# EAGLE design v3s-v0.1.0 (EAGLE 9.2.0)

## Sheet 1 of 5
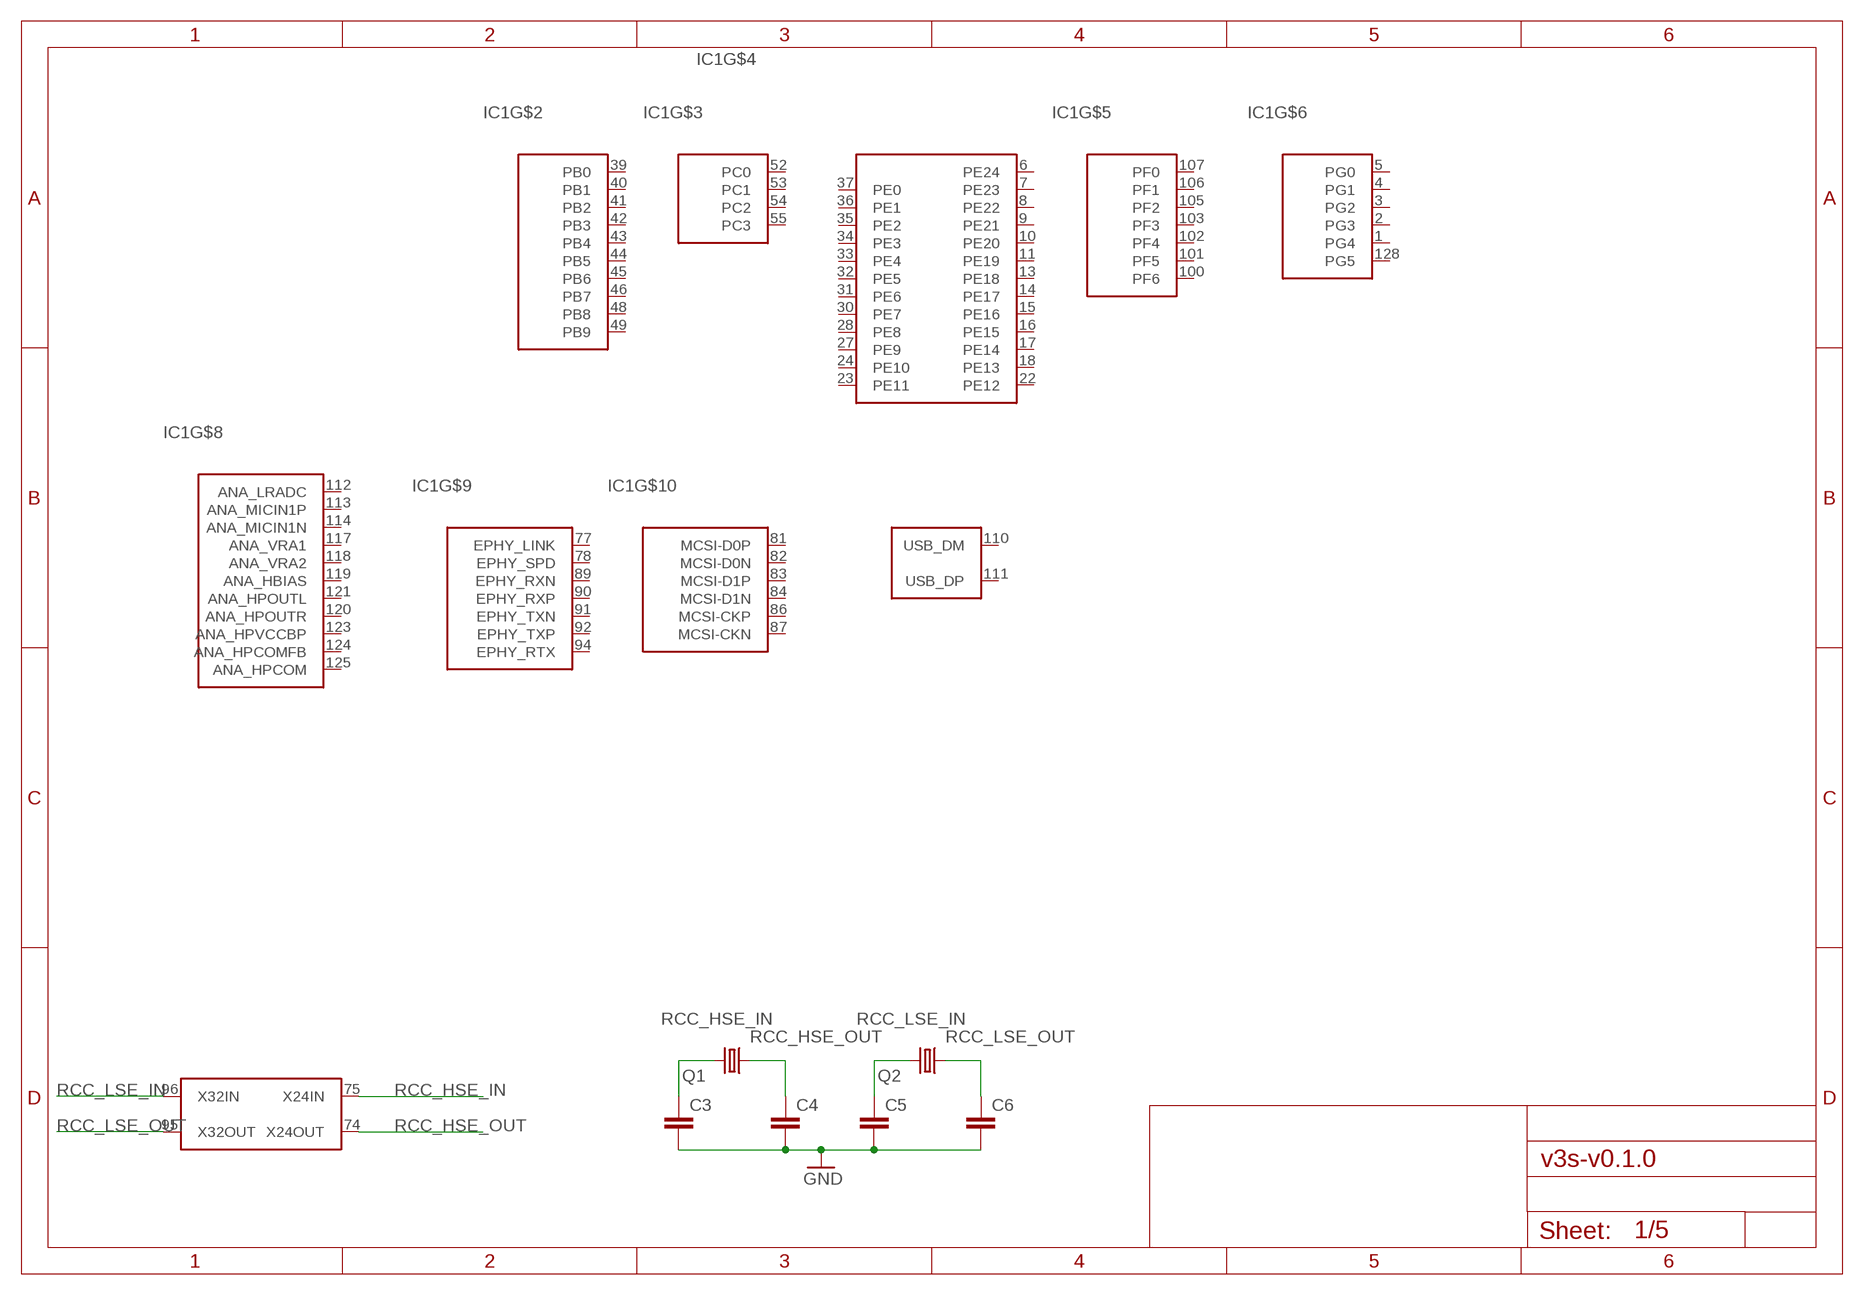
[diagram p0: schematic, sheet 1]

### Parts
C3  C-EUC0402  [C0402]
C4  C-EUC0402  [C0402]
C5  C-EUC0402  [C0402]
C6  C-EUC0402  [C0402]
IC1  V3S  [QFP-128]
Q1  KX-7  [3.2X2.5_KX-7]
Q2  KX-327-NHF  [3.2X1.5]

### Nets
GND: C3.2 C4.2 C5.2 C6.2 ; also sheet 2,4,5
RCC_HSE_IN: C3.1 IC1.75(X24IN) Q1.3
RCC_HSE_OUT: C4.1 IC1.74(X24OUT) Q1.1
RCC_LSE_IN: C5.1 IC1.96(X32IN) Q2.2
RCC_LSE_OUT: C6.1 IC1.95(X32OUT) Q2.1
Unconnected: IC1.1(PG4) IC1.2(PG3) IC1.3(PG2) IC1.4(PG1) IC1.5(PG0) IC1.6(PE24) IC1.7(PE23) IC1.8(PE22) IC1.9(PE21) IC1.10(PE20) IC1.11(PE19) IC1.13(PE18) IC1.14(PE17) IC1.15(PE16) IC1.16(PE15) IC1.17(PE14) IC1.18(PE13) IC1.22(PE12) IC1.23(PE11) IC1.24(PE10) IC1.27(PE9) IC1.28(PE8) IC1.30(PE7) IC1.31(PE6) IC1.32(PE5) IC1.33(PE4) IC1.34(PE3) IC1.35(PE2) IC1.36(PE1) IC1.37(PE0) IC1.39(PB0) IC1.40(PB1) IC1.41(PB2) IC1.42(PB3) IC1.43(PB4) IC1.44(PB5) IC1.45(PB6) IC1.46(PB7) IC1.48(PB8) IC1.49(PB9) IC1.52(PC0) IC1.53(PC1) IC1.54(PC2) IC1.55(PC3) IC1.77(EPHY_LINK) IC1.78(EPHY_SPD) IC1.81(MCSI-D0P) IC1.82(MCSI-D0N) IC1.83(MCSI-D1P) IC1.84(MCSI-D1N) IC1.86(MCSI-CKP) IC1.87(MCSI-CKN) IC1.89(EPHY_RXN) IC1.90(EPHY_RXP) IC1.91(EPHY_TXN) IC1.92(EPHY_TXP) IC1.94(EPHY_RTX) IC1.100(PF6) IC1.101(PF5) IC1.102(PF4) IC1.103(PF3) IC1.105(PF2) IC1.106(PF1) IC1.107(PF0) IC1.110(USB_DM) IC1.111(USB_DP) IC1.112(ANA_LRADC) IC1.113(ANA_MICIN1P) IC1.114(ANA_MICIN1N) IC1.117(ANA_VRA1) IC1.118(ANA_VRA2) IC1.119(ANA_HBIAS) IC1.120(ANA_HPOUTR) IC1.121(ANA_HPOUTL) IC1.123(ANA_HPVCCBP) IC1.124(ANA_HPCOMFB) IC1.125(ANA_HPCOM) IC1.128(PG5)

## Sheet 2 of 5
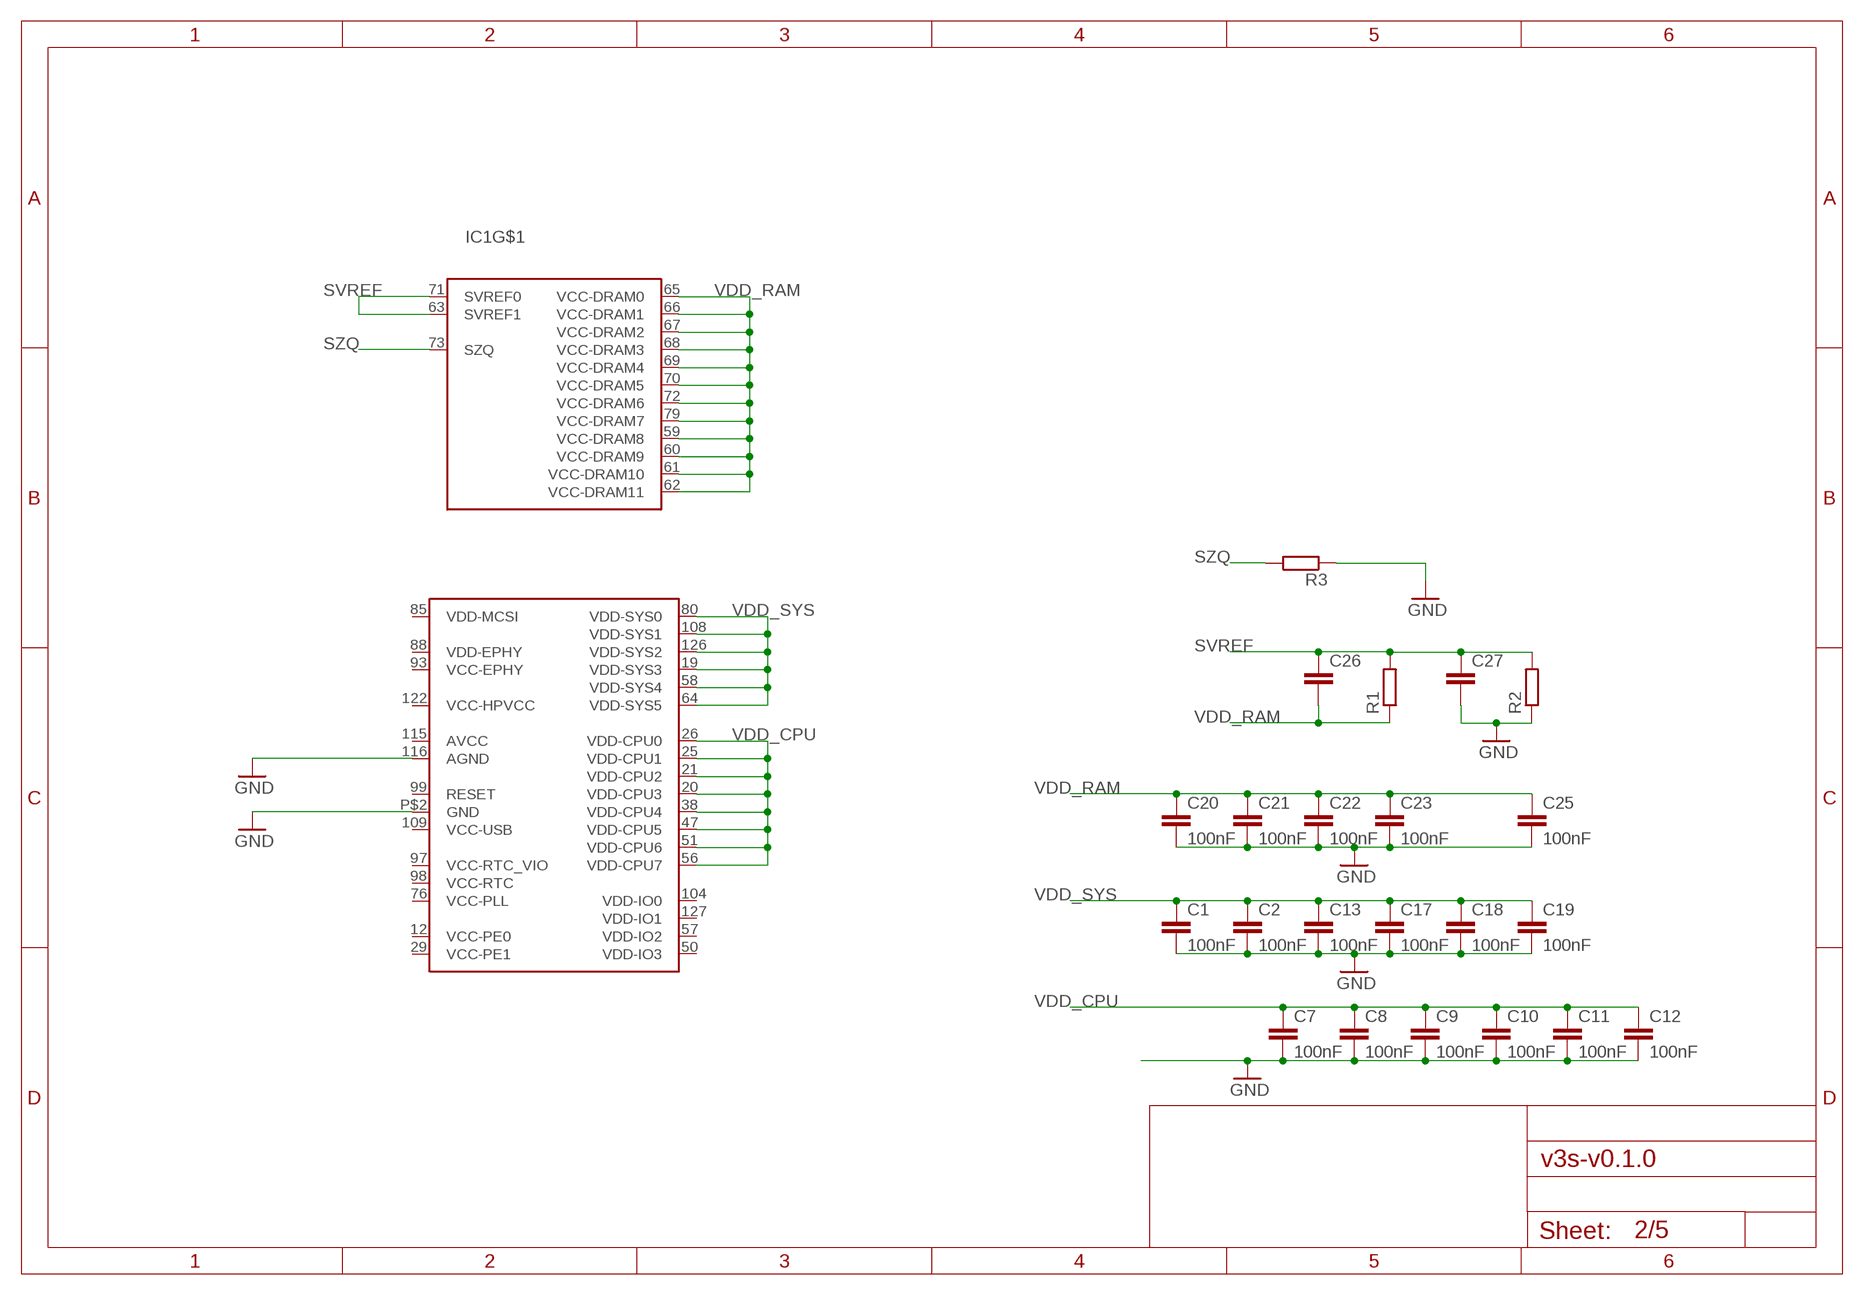
[diagram p1: schematic, sheet 2]

### Parts
C1  100nF  C-EUC0402  [C0402]
C2  100nF  C-EUC0402  [C0402]
C7  100nF  C-EUC0402  [C0402]
C8  100nF  C-EUC0402  [C0402]
C9  100nF  C-EUC0402  [C0402]
C10  100nF  C-EUC0402  [C0402]
C11  100nF  C-EUC0402  [C0402]
C12  100nF  C-EUC0402  [C0402]
C13  100nF  C-EUC0402  [C0402]
C17  100nF  C-EUC0402  [C0402]
C18  100nF  C-EUC0402  [C0402]
C19  100nF  C-EUC0402  [C0402]
C20  100nF  C-EUC0402  [C0402]
C21  100nF  C-EUC0402  [C0402]
C22  100nF  C-EUC0402  [C0402]
C23  100nF  C-EUC0402  [C0402]
C25  100nF  C-EUC0402  [C0402]
C26  C-EUC0402  [C0402]
C27  C-EUC0402  [C0402]
R1  R-EU_R0402  [R0402]
R2  R-EU_R0402  [R0402]
R3  R-EU_R0402  [R0402]

### Nets
GND: C1.2 C2.2 C7.2 C8.2 C9.2 C10.2 C11.2 C12.2 C13.2 C17.2 C18.2 C19.2 C20.2 C21.2 C22.2 C23.2 C25.2 C27.2 IC1.116(AGND) IC1.P$2(GND) R2.1 R3.1 ; also sheet 1,4,5
SVREF: C26.1 C27.1 IC1.63(SVREF1) IC1.71(SVREF0) R1.2 R2.2
SZQ: IC1.73(SZQ) R3.2
VDD_CPU: C7.1 C8.1 C9.1 C10.1 C11.1 C12.1 IC1.20(VDD-CPU3) IC1.21(VDD-CPU2) IC1.25(VDD-CPU1) IC1.26(VDD-CPU0) IC1.38(VDD-CPU4) IC1.47(VDD-CPU5) IC1.51(VDD-CPU6) IC1.56(VDD-CPU7)
VDD_RAM: C20.1 C21.1 C22.1 C23.1 C25.1 C26.2 IC1.59(VCC-DRAM8) IC1.60(VCC-DRAM9) IC1.61(VCC-DRAM10) IC1.62(VCC-DRAM11) IC1.65(VCC-DRAM0) IC1.66(VCC-DRAM1) IC1.67(VCC-DRAM2) IC1.68(VCC-DRAM3) IC1.69(VCC-DRAM4) IC1.70(VCC-DRAM5) IC1.72(VCC-DRAM6) IC1.79(VCC-DRAM7) R1.1
VDD_SYS: C1.1 C2.1 C13.1 C17.1 C18.1 C19.1 IC1.19(VDD-SYS3) IC1.58(VDD-SYS4) IC1.64(VDD-SYS5) IC1.80(VDD-SYS0) IC1.108(VDD-SYS1) IC1.126(VDD-SYS2)
Unconnected: IC1.12(VCC-PE0) IC1.29(VCC-PE1) IC1.50(VDD-IO3) IC1.57(VDD-IO2) IC1.76(VCC-PLL) IC1.85(VDD-MCSI) IC1.88(VDD-EPHY) IC1.93(VCC-EPHY) IC1.97(VCC-RTC_VIO) IC1.98(VCC-RTC) IC1.99(RESET) IC1.104(VDD-IO0) IC1.109(VCC-USB) IC1.115(AVCC) IC1.122(VCC-HPVCC) IC1.127(VDD-IO1)

## Sheet 3 of 5
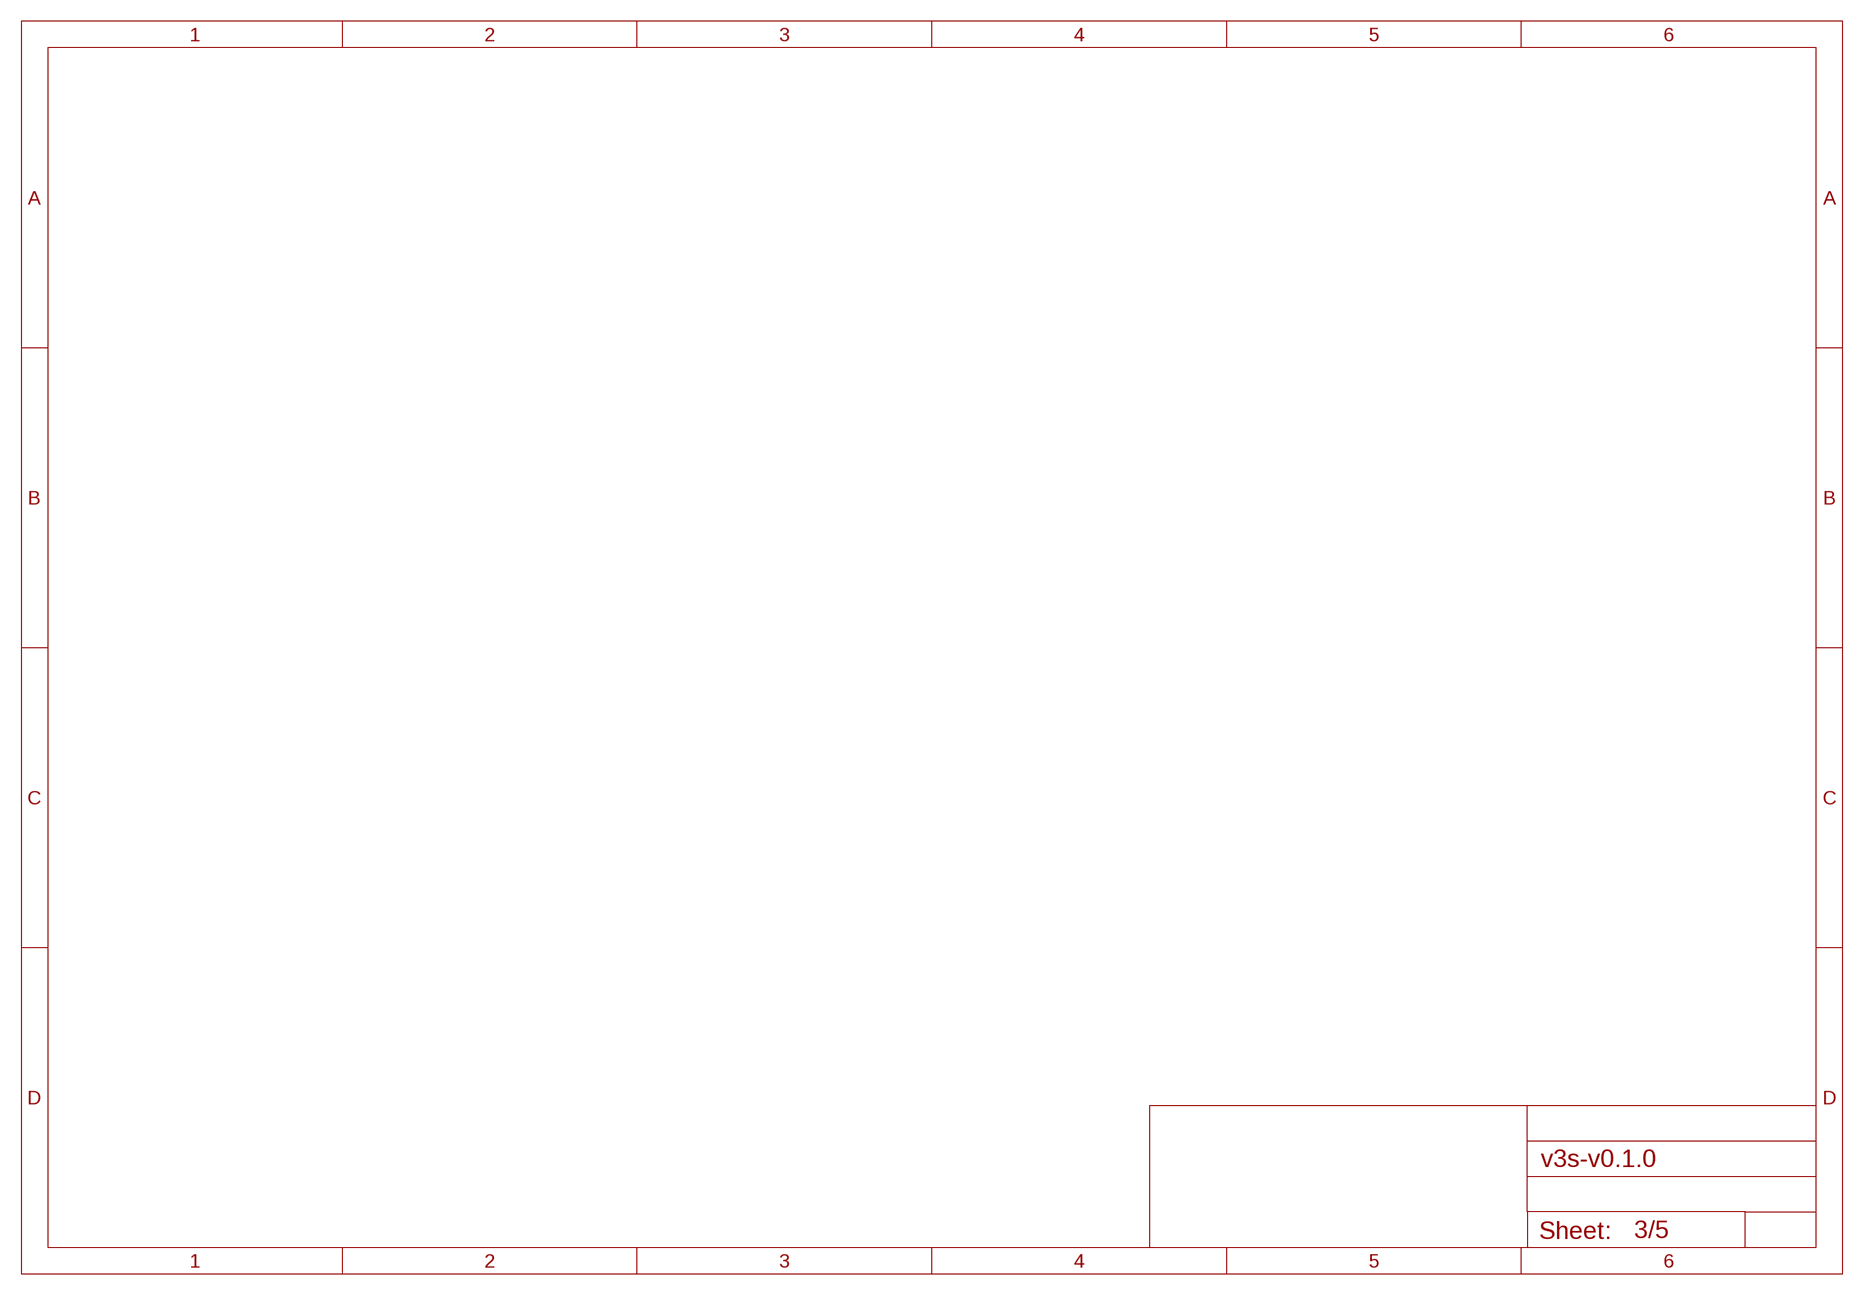
[diagram p2: schematic, sheet 3]

## Sheet 4 of 5
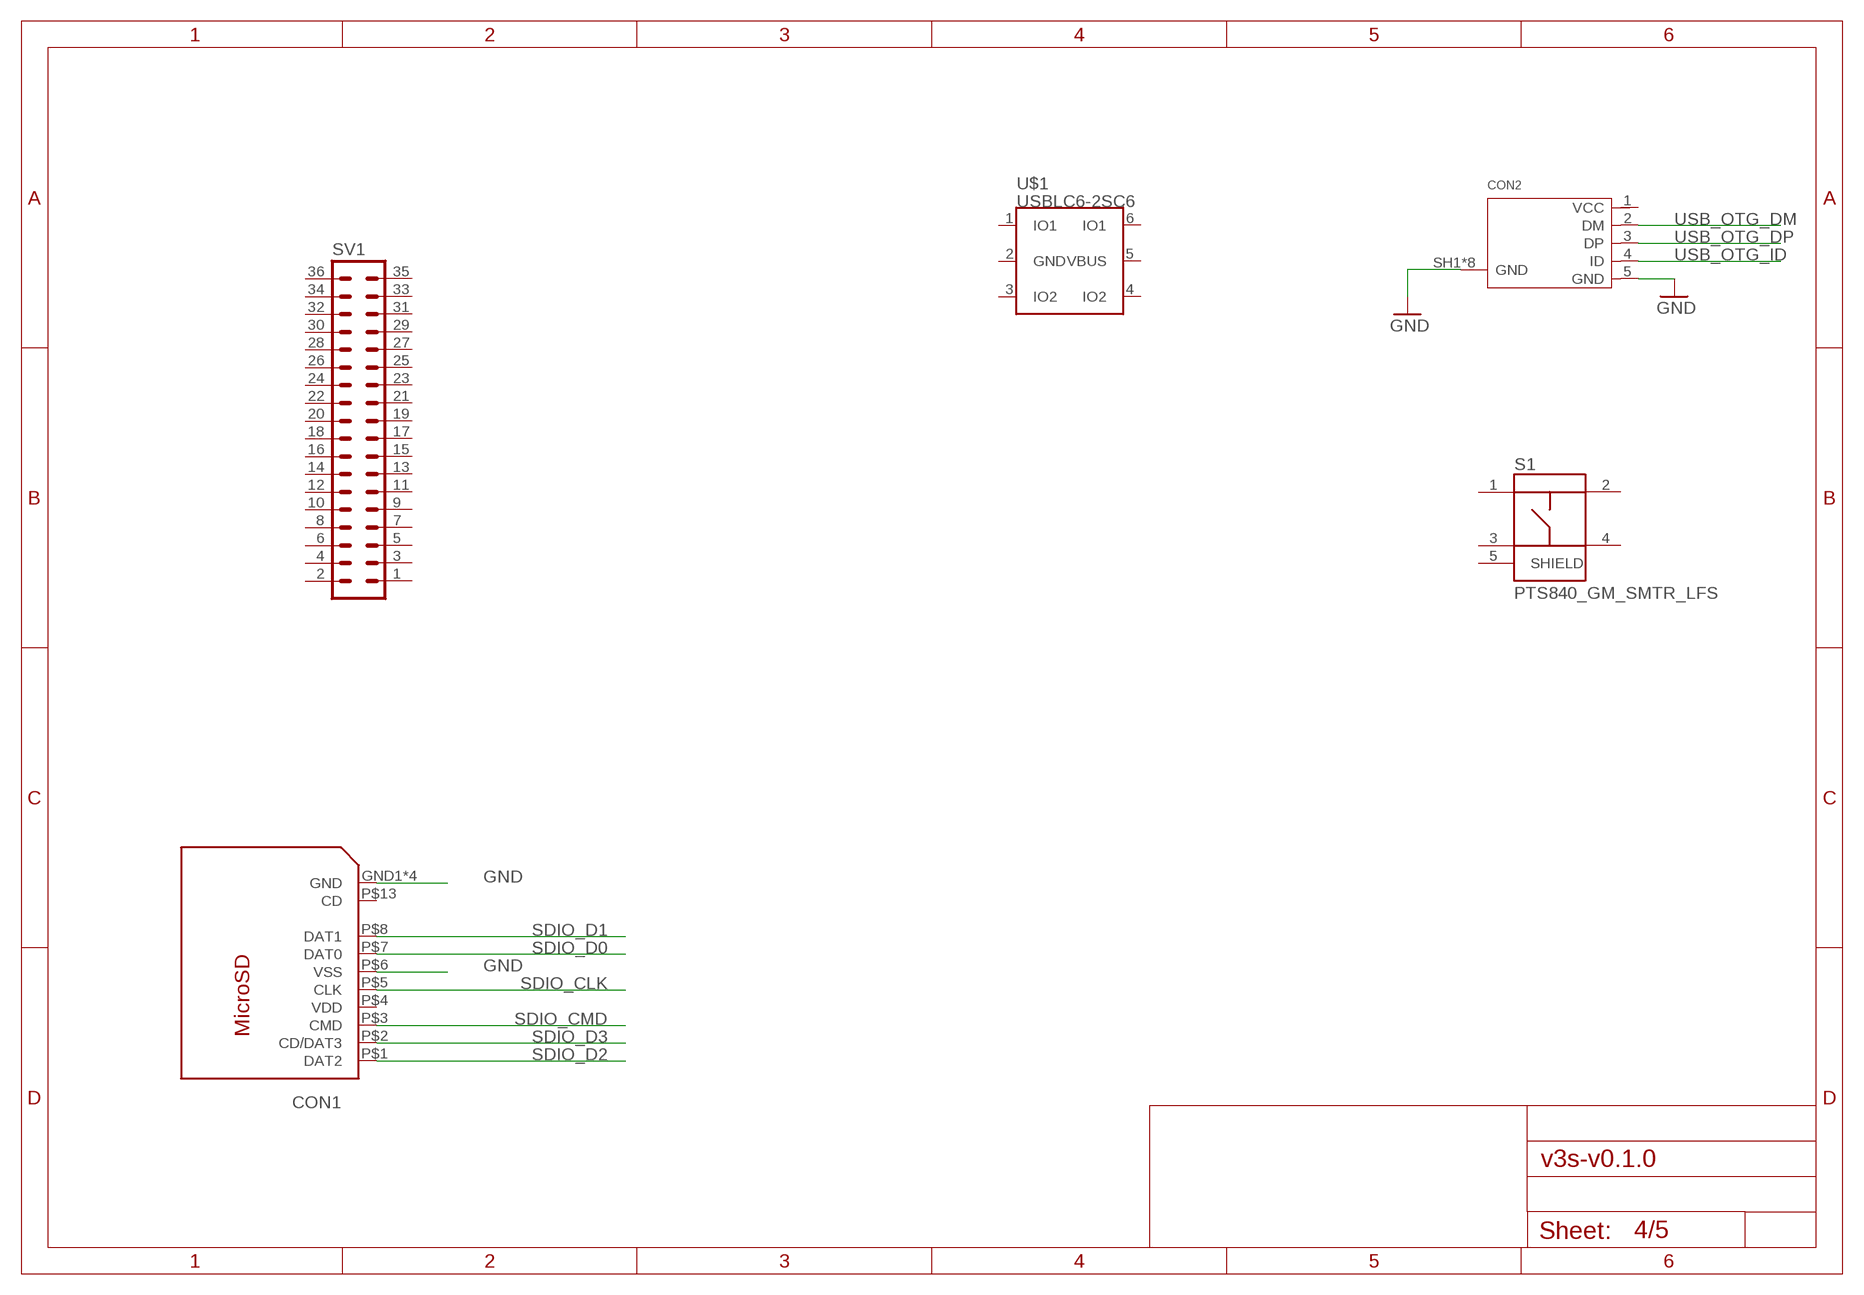
[diagram p3: schematic, sheet 4]

### Parts
CON1  112J-TXAR  [112J]
CON2  10118194-0001LF  [10118194]
S1  PTS840_GM_SMTR_LFS  [SW_PTS840GMSMTRLFS]
SV1  MA18-2  [MA18-2]
U$1  USBLC6-2SC6  [SOT95P280X110-6]

### Nets
GND: CON1.GND1(GND) CON1.GND2(GND) CON1.GND3(GND) CON1.GND4(GND) CON1.P$6(VSS) CON2.5(GND) CON2.SH1(GND) CON2.SH2(GND) CON2.SH3(GND) CON2.SH4(GND) CON2.SH5(GND) CON2.SH6(GND) CON2.SH7(GND) CON2.SH8(GND) ; also sheet 1,2,5
SDIO_CLK: CON1.P$5(CLK)
SDIO_CMD: CON1.P$3(CMD)
SDIO_D0: CON1.P$7(DAT0)
SDIO_D1: CON1.P$8(DAT1)
SDIO_D2: CON1.P$1(DAT2)
SDIO_D3: CON1.P$2(CD/DAT3)
USB_OTG_DM: CON2.2(DM)
USB_OTG_DP: CON2.3(DP)
USB_OTG_ID: CON2.4(ID)
Unconnected: CON1.P$4(VDD) CON1.P$13(CD) CON2.1(VCC) S1.1 S1.2 S1.3 S1.4 S1.5(SHIELD) SV1.1 SV1.2 SV1.3 SV1.4 SV1.5 SV1.6 SV1.7 SV1.8 SV1.9 SV1.10 SV1.11 SV1.12 SV1.13 SV1.14 SV1.15 SV1.16 SV1.17 SV1.18 SV1.19 SV1.20 SV1.21 SV1.22 SV1.23 SV1.24 SV1.25 SV1.26 SV1.27 SV1.28 SV1.29 SV1.30 SV1.31 SV1.32 SV1.33 SV1.34 SV1.35 SV1.36 U$1.1(IO1) U$1.2(GND) U$1.3(IO2) U$1.4(IO2) U$1.5(VBUS) U$1.6(IO1)

## Sheet 5 of 5
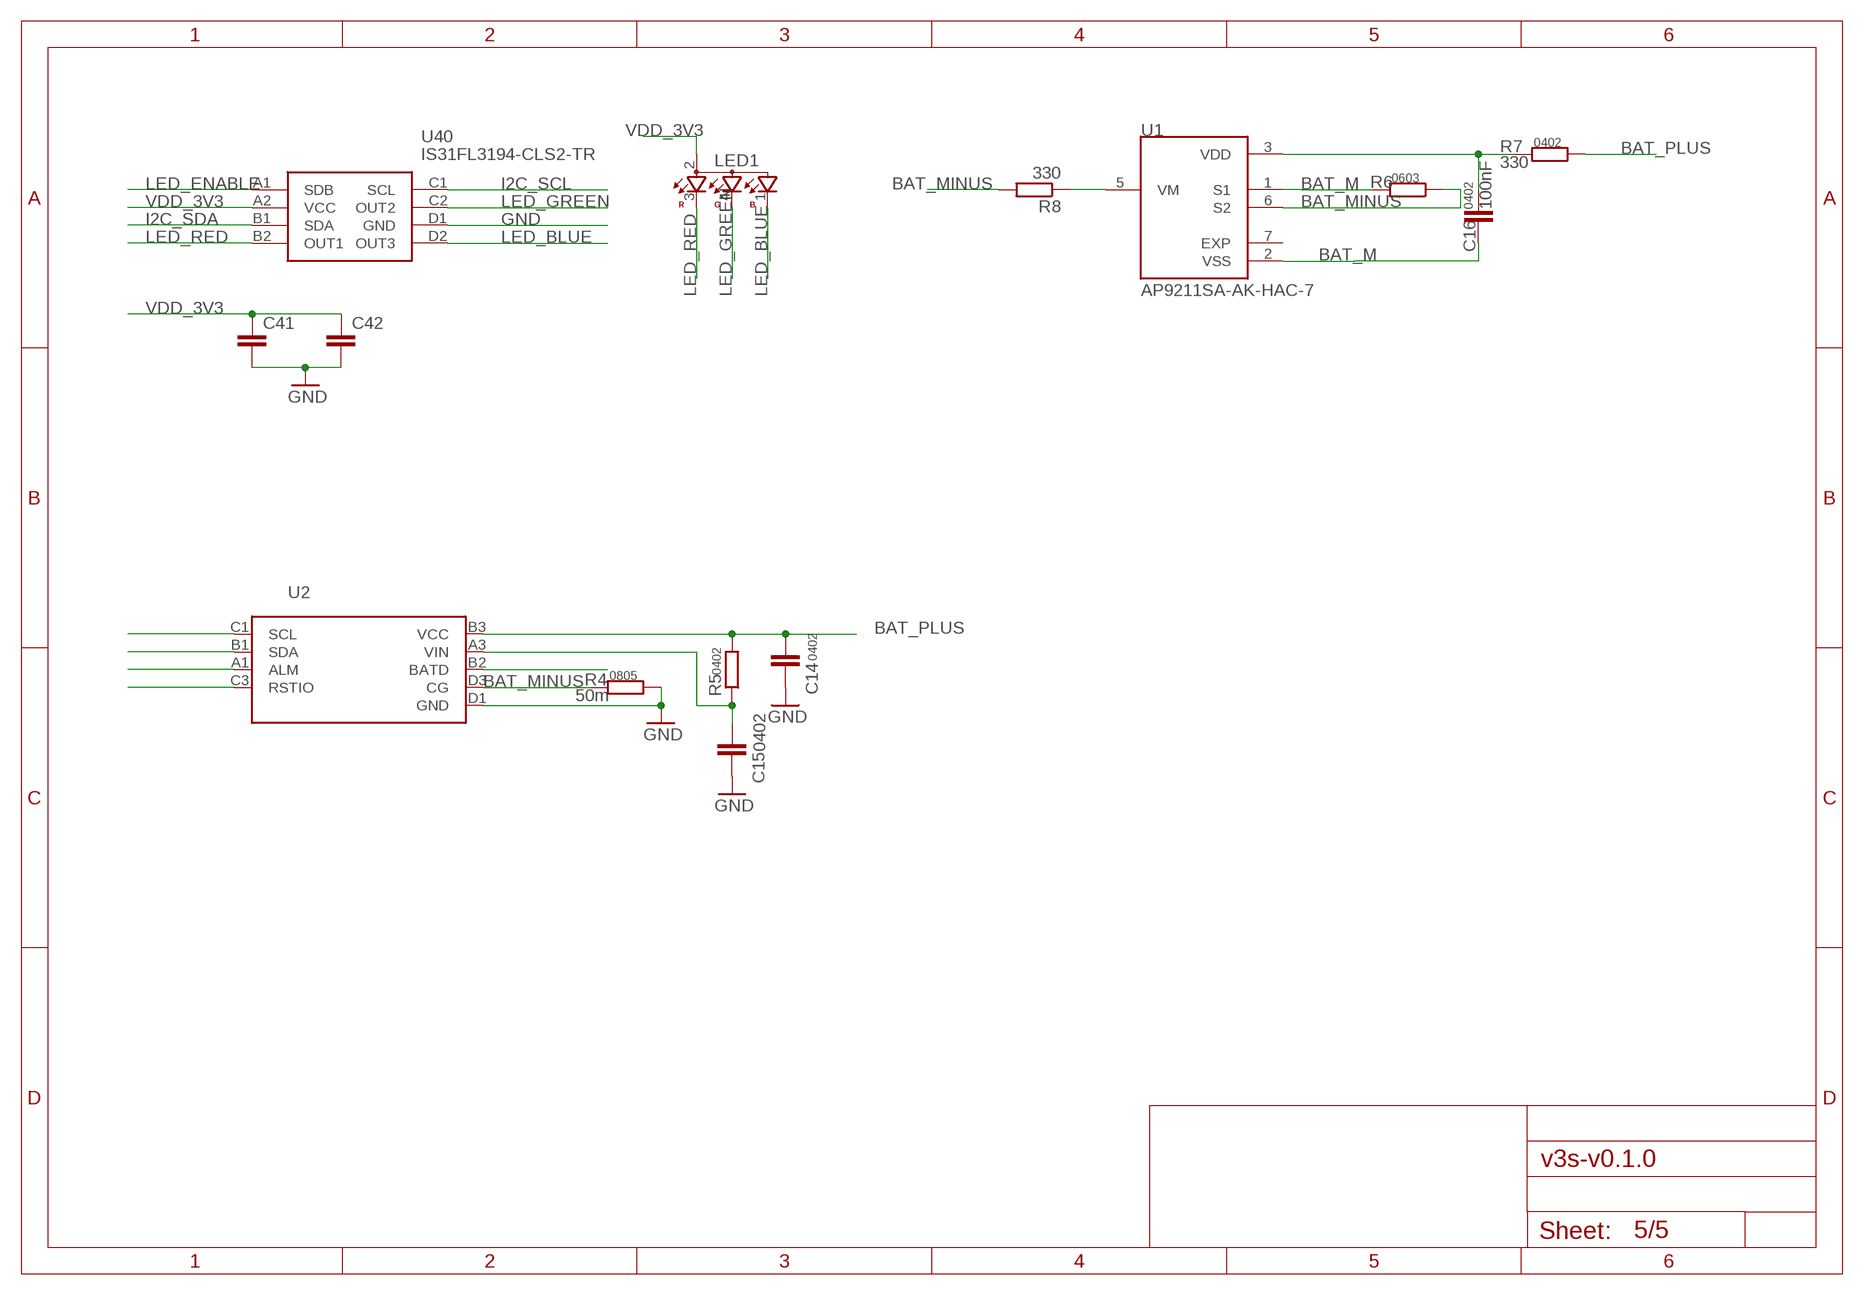
[diagram p4: schematic, sheet 5]

### Parts
C14  C-EUC0402  [C0402]
C15  C-EUC0402  [C0402]
C16  100nF  C-EUC0402  [C0402]
C41  C-EUC0402  [C0402]
C42  C-EUC0402  [C0402]
LED1  OSTB1204C1E  [321015RGB]
R4  50m  R-EU_R0805  [R0805]
R5  R-EU_R0402  [R0402]
R6  R-EU_R0603  [R0603]
R7  330  R-EU_R0402  [R0402]
R8  330  R-EU_R0402  [R0402]
U1  AP9211SA-AK-HAC-7  [DFN200X300X60-7N]
U2  STC3115  [BGA12C40P4X3_137X201X65]
U40  IS31FL3194-CLS2-TR  [BGA8C40P2X4_99X159X42]

### Nets
BAT_M: C16.2 R6.2 U1.1(S1) U1.2(VSS)
BAT_MINUS: R4.2 R6.1 R8.2 U1.6(S2) U2.D3(CG)
BAT_PLUS: C14.1 R5.2 R7.1 U2.B3(VCC)
GND: C14.2 C15.2 C41.2 C42.2 R4.1 U2.D1(GND) U40.D1(GND) ; also sheet 1,2,4
I2C_SCL: U40.C1(SCL)
I2C_SDA: U40.B1(SDA)
LED_BLUE: LED1.1 U40.D2(OUT3)
LED_ENABLE: U40.A1(SDB)
LED_GREEN: LED1.4 U40.C2(OUT2)
LED_RED: LED1.3 U40.B2(OUT1)
N$6: U2.C1(SCL)
N$8: U2.B1(SDA)
N$11: U2.A1(ALM)
N$12: U2.C3(RSTIO)
N$13: C16.1 R7.2 U1.3(VDD)
N$15: C15.1 R5.1 U2.A3(VIN)
N$16: U2.B2(BATD)
N$18: R8.1 U1.5(VM)
VDD_3V3: C41.1 C42.1 LED1.2 U40.A2(VCC)

### Notes on the sheet
- 0402
- 0603
- 0402
- 0402
- 0402
- 0805
- 0402

## Power pins joined to a net without a drawn wire
EXP: U1.7(EXP)

## Library data of the parts
C1-C23 C25-C27 C41 C42 = rcl:C-EU: CAPACITOR, European symbol; SPICEPREFIX: C
CON1 = parts-attend:112J-TXAR
CON2 = parts-amphenol:10118194-00
IC1 = parts-allwinner:V3S
LED1 = parts-optosupply:OSTB1204
Q1 = crystal-geyer_V1_0:KX: Quartz Crystals (MHz) SMD: KX - Serie Model Size l/w/h [mm] Frequency Range Frequency Stability Temp. Range [°C] Load Capacitance AECQ 200 availabel Datasheet KX-4 KX-5 KX-6 KX-7 KX-9A KX-9B KX-12A KX-12B KX-13 KX-20 KX-K KX-KS 1.6/1.2/0.3 2.0/1.6/0.45 2.5/2.0/0.55 3.2/2.5/0.8 5.0/3.2/1.0 5.0/3.2/1.1 6.0/3.5/1.1 6.0/3.5/1.0 7.0/5.0 /1.3 11.6/5.5/1.6 12.3/4.5/4.2 12.3/4.5/3.2 24.0 ~ 80.0 MHz 16.0 ~ 80.0 MHz 12.0 ~ 80.0 MHz 8.0 ~ 60.0 MHz 7,68 ~ 300,0 MHz 8,0 ~ 50,0 MHz 8,0 ~ 150,0 MHz 8,0 ~ 50,0 MHz 6,0 ~ 160,0 MHz 3,579 ~ 25,0 MHz 3,579 ~ 70,0 MHz 3,579 ~ 70,0 MHz ±10 … ±50ppm ±10 … ±50ppm ±10 … ±50ppm ±10 … ±50ppm ±10 … ±50ppm ±10 … ±50ppm ±10 … ±50ppm ±10 … ±50ppm ±10 … ±50ppm ±50ppm ±10 … ±50ppm ±10 … ±50ppm (*) -40°C …+85°C (*) -40°C …+125°C (*) -40°C …+125°C (*) -40°C …+125°C (*) -40°C …+105°C (*) -40°C …+105°C (*) -40°C …+125°C (*) -40°C …+105°C (*) -40°C …+105°C (*) -40°C …+105°C (*) -40°C …+85°C (*) -40°C …+85°C 8, 8…16 8, 8…16 10, 8…16 12, 7…20 16, 10…20 16, 10…20 16, 10…20 16, 12…20 16, 12…20 16, 12…20 16, 12…30 16, 12…30 - yes yes yes - - - - - - - - KX-4.pdf <http://www.geyer-electronic.de/uploads/tx_userartikelfrequenz/GEYER-KX-4.pdf> KX-5.pdf <http://www.geyer-electronic.de/uploads/tx_userartikelfrequenz/GEYER-KX-5.pdf> KX-6.pdf <http://www.geyer-electronic.de/uploads/tx_userartikelfrequenz/GEYER-KX-6.pdf> KX-7.pdf <http://www.geyer-electronic.de/uploads/tx_userartikelfrequenz/GEYER-KX-7.pdf> KX-9A.pdf <http://www.geyer-electronic.de/uploads/tx_userartikelfrequenz/GEYER-KX-9A.pdf> KX-9B.pdf <http://www.geyer-electronic.de/uploads/tx_userartikelfrequenz/GEYER-KX-9B.pdf> KX-12A.pdf <http://www.geyer-electronic.de/uploads/tx_userartikelfrequenz/GEYER-KX-12A.pdf> KX-12B.pdf <http://www.geyer-electronic.de/uploads/tx_userartikelfrequenz/GEYER-KX-12B.pdf> KX-13.pdf <http://www.geyer-electronic.de/uploads/tx_userartikelfrequenz/GEYER-KX-13.pdf> KX-20.pdf <http://www.geyer-electronic.de/uploads/tx_userartikelfrequenz/GEYER-KX-20.pdf> KX-K.pdf <http://www.geyer-electronic.de/uploads/tx_userartikelfrequenz/GEYER-KX-K.pdf> KX-KS.pdf <http://www.geyer-electronic.de/uploads/tx_userartikelfrequenz/GEYER-KX-KS.pdf> <http://www.geyer-electronic.de/fileadmin/template/img/logo-geyer-electronic.png> Details see: http://www.geyer-electronic.de/Frequenz-Produkte.9.0.html Created 2016-06-07, Hans Locher 2016 (C) Geyer Quartz Technology KX4,KX5,KX6,KX7,KX9A,KX9B,KX12A,KX12B,KX13,KX20,KXK,KXKS;1612;2016;2520;3225;5032;6035;7050;11655;12345;1,6x1,2;2,0x1,6;2,5x2,0;3,2x2,5;5,0x3,2;6,0x3,5;7,0x5,0;11,6x5,5;12,3x4,5;12,3x4,5;1.6x1.2;2.0x1.6;2.5x2.0;3.2x2.5;5.0x3.2;6.0x3.5;7.0x5.0;11.6x5.5;12.3x4.5;12.3x4.5;
Q2 = crystal-geyer_V1_0:KX-327: Tuning Fork Crystals (kHz) SMD: KX327 - Serie Model Size l/w/h [mm] Frequency Range Frequency Stability Temp. Range [°C] Load Capacitance AECQ 200 availabel Datasheet KX-327VT KX-327FT KX-327RT KX-327NHT KX-327NHF KX-327L KX-327S 1.25/1.05/0.5 1.6/1.0/0.5 2.0/1.2/0.6 3.2/1.5/0.8 3.2/1.5/0.8 7.0/1.5/1.4 8.2/3.8/2.5 32,768 kHz 32,768 kHz 32,768 kHz 32,768 kHz 32,768 kHz 32,768 kHz 32,768 kHz ±10 … ±20ppm ±10 … ±20ppm ±10 … ±20ppm ±10 … ±20ppm ±10 … ±20ppm ±10 … ±20ppm ±5 … ±20ppm (*) -40°C …+85°C (*) -40°C …+85°C (*) -40°C …+85°C (*) -40°C …+85°C (*) -40°C …+125°C (*) -40°C …+85°C (*) -40°C …+85°C 7/9/12,5 7/9/12,5 7/9/12,6 7/9/12,5 9/12,5 7/9/12,5 6/12,5 - - - - yes - - KX-327VT.pdf <http://www.geyer-electronic.de/uploads/tx_userartikelfrequenz/GEYER-KX-327VT.pdf> KX-327FT.pdf <http://www.geyer-electronic.de/uploads/tx_userartikelfrequenz/GEYER-KX-327FT.pdf> KX-327RT.pdf <http://www.geyer-electronic.de/uploads/tx_userartikelfrequenz/GEYER-KX-327RT.pdf> KX-327NHT.pdf <http://www.geyer-electronic.de/uploads/tx_userartikelfrequenz/GEYER-KX-327NHT.pdf> KX-327NHF.pdf <http://www.geyer-electronic.de/uploads/tx_userartikelfrequenz/GEYER-KX-327NHF.pdf> KX-327L.pdf <http://www.geyer-electronic.de/uploads/tx_userartikelfrequenz/GEYER-KX-327L.pdf> KX-327S.pdf <http://www.geyer-electronic.de/uploads/tx_userartikelfrequenz/GEYER-KX-327S.pdf> <http://www.geyer-electronic.de/fileadmin/template/img/logo-geyer-electronic.png> Details see: http://www.geyer-electronic.de/Frequenz-Produkte.9.0.html Created 2016-06-07, Hans Locher 2016 (C) Geyer Quartz Technology KX327VT,KX327FT,KX327RT,KX327NHT,KX327NHF,KX327S,KX327L;125105;1610;2012;3215;7015;8238;1,25x1,05,1.25x1.05;1,6x1,0,1.6x1.0;2,0x1,2,2.0x1.2;3,2x1,5,3.2x1.5;8,2x3,8,8.2x3.8,7.0x1.5,7,0x1,532.768kHz
R1-R8 = rcl:R-EU_: RESISTOR, European symbol; SPICEPREFIX: R
S1 = parts_ck:PTS840_GM_SMTR_LFS: Switch Tactile N.O. SPST Button Gull Wing 0.05A 12VDC 100000Cycle 1.57N SMD T/R; AVAILABILITY: Unavailable; DESCRIPTION: Switch Tactile N.O. SPST Button Gull Wing 0.05A 12VDC 100000Cycle 1.57N SMD T/R; MF: C&K; MP: PTS840 GM SMTR LFS; PACKAGE: None; PRICE: None
SV1 = con-lstb:MA18-2: PIN HEADER; OC_FARNELL: unknown; OC_NEWARK: unknown
U1 = parts-diodes:AP9211SA-AK-HAC-7: Battery Protection Li-Ion Packs 2.4V to 4.25V 6-Pin UDFN T/R; AVAILABILITY: Unavailable; DESCRIPTION: Battery Protection Li-Ion Packs 2.4V to 4.25V 6-Pin UDFN T/R; MF: Diodes Inc.; MP: AP9211SA-AK-HAC-7; PACKAGE: UDFN-6 Diodes Inc.; PRICE: None
U2 = parts-st:STC3115
U40 = parts-issi:IS31FL3194-CLS2-TR: LED Lighting Drivers 3-Channel Fun LED Driver Source: Datasheet <https://componentsearchengine.com/Datasheets/1/IS31FL3194-CLS2-TR.pdf>; DESCRIPTION: LED Lighting Drivers 3-Channel Fun LED Driver; HEIGHT: 0.422mm; MANUFACTURER_NAME: Integrated Silicon Solution Inc.; MANUFACTURER_PART_NUMBER: IS31FL3194-CLS2-TR; MOUSER_PART_NUMBER: 870-IS31FL3194CLS2TR
U$1 = parts-st:USBLC6-2

## Board
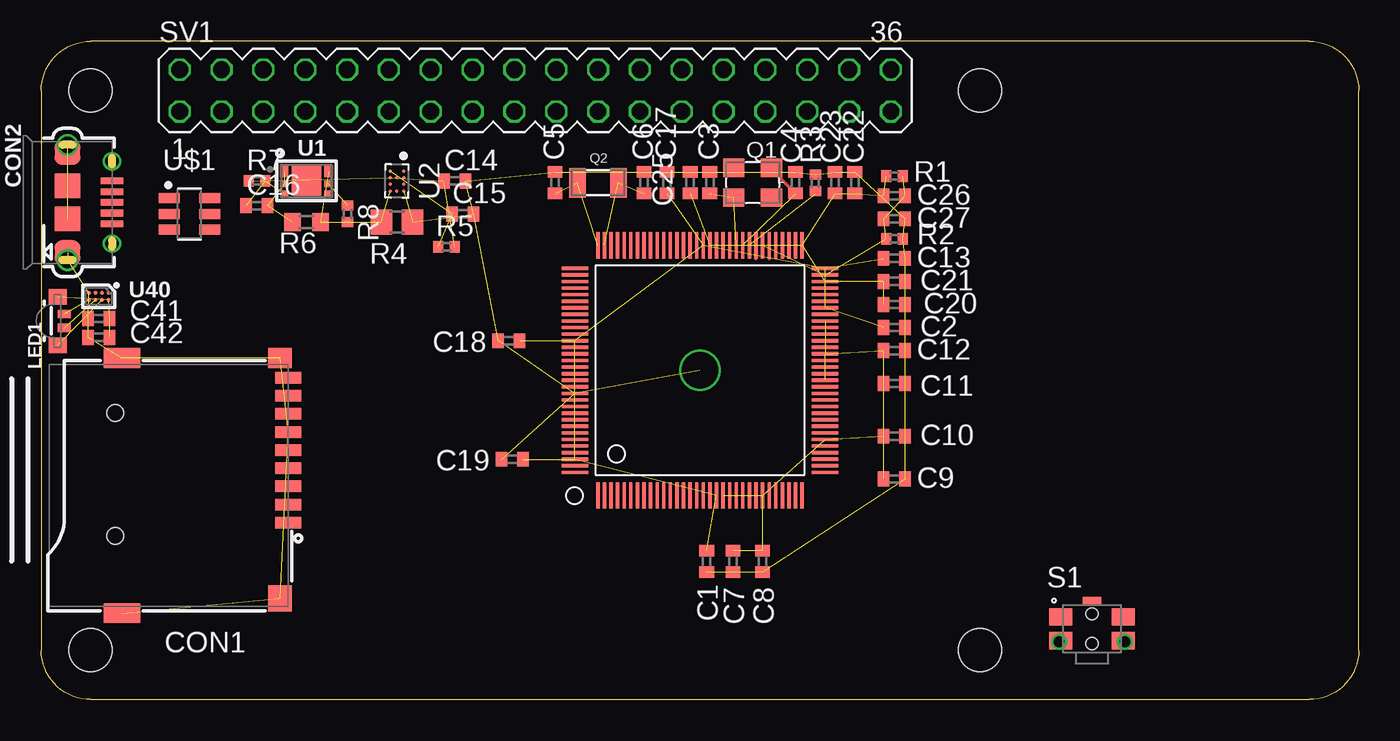
[diagram p5: board, top side]
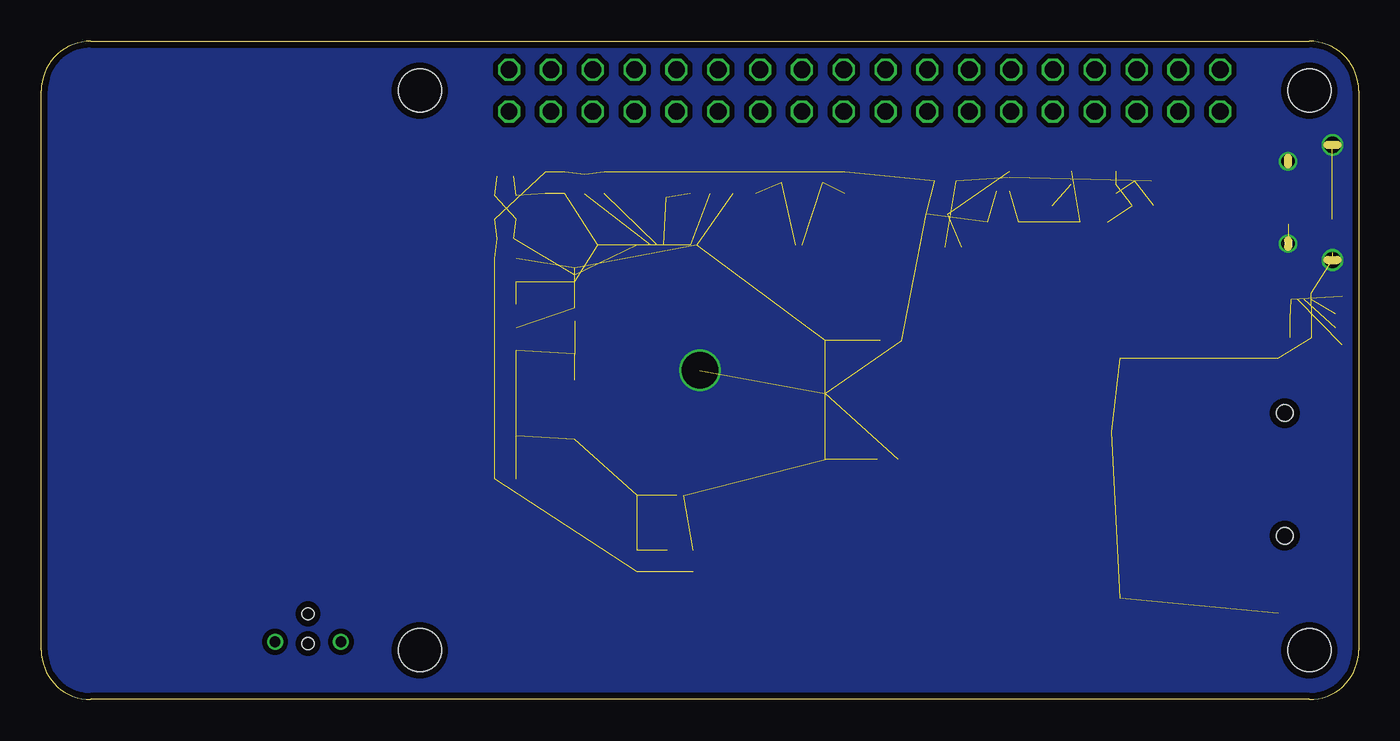
[diagram p6: board, bottom side, seen from below]

Size 80 x 40 mm. Coordinates in mm from the lower left corner, seen from the top.
Outline: 3,0 77,0 arc90 80,3 80,37 arc90 77,40 3,40 arc90 0,37 0,3 arc90 3,0
Copper layers (1*2*15*16): Top 0.035mm / dielectric 0.4mm / Route2 0.035mm / dielectric 0.4mm / Route15 0.035mm / dielectric 0.4mm / Bottom 0.035mm
Design rules "default *": minimum track width 0.16mm, minimum drill 0.3mm, track to track 6mil, track to pad 6mil, pad to pad 6mil, via to via 6mil, smd to smd 6mil, copper to edge 0.4mm, drill to drill 6mil, minimum pad ring 0.16mm, minimum via ring 0.16mm, stop-mask expansion 4mil, vias tented up to drill 0mil, thermal gap 10mil
Holes 2.6 mm at 3,3 3,37 57,37 57,3
tRestrict: area 0.5,34.5 to 5.5,39.5; area 54.5,34.5 to 59.5,39.5; area 74.5,34.5 to 79.5,39.5; area 54.5,0.5 to 59.5,5.5; area 0.5,0.5 to 5.5,5.5; area 74.5,0.5 to 79.5,5.5

### Footprints (pad centres in the part's own frame; a part is rotated, then mirrored left to right if it is on the bottom)
C0402 = smd 0.7 x 0.9: 1 -0.65,0; 2 0.65,0
112J = smd 1.2 x 1.4: GND1 -7.75,-0.5 | smd 1.2 x 2.2: GND2 -7.75,-10.1; GND3 7.75,-10.1 | smd 1.6 x 1.4: GND4 6.85,-0.5 | smd 0.7 x 1.6: P$1 2.25,0; P$2 1.15,0; P$3 0.05,0; P$4 -1.05,0; P$5 -2.15,0; P$6 -3.25,0; P$7 -4.35,0; P$8 -5.45,0; P$13 -6.55,0 | hole 1: -4.4,-10.5; 3.05,-10.5
10118194 = smd 0.4 x 1.35: 1 -1.3,2.7; 2 -0.65,2.7; 3 0,2.7; 4 0.65,2.7; 5 1.3,2.7 | drill 0.8: SH1 -2.5,2.7; SH2 2.5,2.7 | drill 1: SH3 -3.5,0; SH8 3.5,0 | smd 1.5 x 1.55: SH4 -3.05,0; SH5 -1,0; SH6 1,0; SH7 3.05,0
QFP-128 = smd 0.2 x 1.6: 1 -6.2,-7.6; 2 -5.8,-7.6; 3 -5.4,-7.6; 4 -5,-7.6; 5 -4.6,-7.6; 6 -4.2,-7.6; 7 -3.8,-7.6; 8 -3.4,-7.6; 9 -3,-7.6; 10 -2.6,-7.6; 11 -2.2,-7.6; 12 -1.8,-7.6; 13 -1.4,-7.6; 14 -1,-7.6; 15 -0.6,-7.6; 16 -0.2,-7.6; 17 0.2,-7.6; 18 0.6,-7.6; 19 1,-7.6; 20 1.4,-7.6; 21 1.8,-7.6; 22 2.2,-7.6; 23 2.6,-7.6; 24 3,-7.6; 25 3.4,-7.6; 26 3.8,-7.6; 27 4.2,-7.6; 28 4.6,-7.6; 29 5,-7.6; 30 5.4,-7.6; 31 5.8,-7.6; 32 6.2,-7.6; 65 6.2,7.6; 66 5.8,7.6; 67 5.4,7.6; 68 5,7.6; 69 4.6,7.6; 70 4.2,7.6; 71 3.8,7.6; 72 3.4,7.6; 73 3,7.6; 74 2.6,7.6; 75 2.2,7.6; 76 1.8,7.6; 77 1.4,7.6; 78 1,7.6; 79 0.6,7.6; 80 0.2,7.6; 81 -0.2,7.6; 82 -0.6,7.6; 83 -1,7.6; 84 -1.4,7.6; 85 -1.8,7.6; 86 -2.2,7.6; 87 -2.6,7.6; 88 -3,7.6; 89 -3.4,7.6; 90 -3.8,7.6; 91 -4.2,7.6; 92 -4.6,7.6; 93 -5,7.6; 94 -5.4,7.6; 95 -5.8,7.6; 96 -6.2,7.6 | smd 1.6 x 0.2: 33 7.6,-6.2; 34 7.6,-5.8; 35 7.6,-5.4; 36 7.6,-5; 37 7.6,-4.6; 38 7.6,-4.2; 39 7.6,-3.8; 40 7.6,-3.4; 41 7.6,-3; 42 7.6,-2.6; 43 7.6,-2.2; 44 7.6,-1.8; 45 7.6,-1.4; 46 7.6,-1; 47 7.6,-0.6; 48 7.6,-0.2; 49 7.6,0.2; 50 7.6,0.6; 51 7.6,1; 52 7.6,1.4; 53 7.6,1.8; 54 7.6,2.2; 55 7.6,2.6; 56 7.6,3; 57 7.6,3.4; 58 7.6,3.8; 59 7.6,4.2; 60 7.6,4.6; 61 7.6,5; 62 7.6,5.4; 63 7.6,5.8; 64 7.6,6.2; 97 -7.6,6.2; 98 -7.6,5.8; 99 -7.6,5.4; 100 -7.6,5; 101 -7.6,4.6; 102 -7.6,4.2; 103 -7.6,3.8; 104 -7.6,3.4; 105 -7.6,3; 106 -7.6,2.6; 107 -7.6,2.2; 108 -7.6,1.8; 109 -7.6,1.4; 110 -7.6,1; 111 -7.6,0.6; 112 -7.6,0.2; 113 -7.6,-0.2; 114 -7.6,-0.6; 115 -7.6,-1; 116 -7.6,-1.4; 117 -7.6,-1.8; 118 -7.6,-2.2; 119 -7.6,-2.6; 120 -7.6,-3; 121 -7.6,-3.4; 122 -7.6,-3.8; 123 -7.6,-4.2; 124 -7.6,-4.6; 125 -7.6,-5; 126 -7.6,-5.4; 127 -7.6,-5.8; 128 -7.6,-6.2 | drill 2.2: P$2 0,0
321015RGB = smd 0.5 x 0.8: 1 -0.415,0.4; 4 0.415,0.4 | smd 0.95 x 1.1: 2 -1.475,0; 3 1.475,0
3.2X2.5_KX-7 = smd 1.3 x 1.1: 1 -1.15,-0.9; 2 1.15,-0.9; 3 1.15,0.9; 4 -1.15,0.9
3.2X1.5 = smd 1 x 1.8: 1 -1.25,0; 2 1.25,0
R0402 = smd 0.6 x 0.7: 1 -0.5,0; 2 0.5,0
R0805 = smd 1.3 x 1.5: 1 -0.95,0; 2 0.95,0
R0603 = smd 1 x 1.1: 1 -0.85,0; 2 0.85,0
SW_PTS840GMSMTRLFS = smd 1.4 x 1.05: 1 -1.9,0.725; 2 1.9,0.725; 3 -1.9,-0.725; 4 1.9,-0.725 | smd 1.1 x 0.5: 5 0,1.7 | drill 0.65 pad 0.7: P$1 -2,-0.8; P$2 2,-0.8 | hole 0.7: 0,-0.9; 0,0.9
MA18-2 = drill 1.016 octagon: 1 -21.59,-1.27; 2 -21.59,1.27; 3 -19.05,-1.27; 4 -19.05,1.27; 5 -16.51,-1.27; 6 -16.51,1.27; 7 -13.97,-1.27; 8 -13.97,1.27; 9 -11.43,-1.27; 10 -11.43,1.27; 11 -8.89,-1.27; 12 -8.89,1.27; 13 -6.35,-1.27; 14 -6.35,1.27; 15 -3.81,-1.27; 16 -3.81,1.27; 17 -1.27,-1.27; 18 -1.27,1.27; 19 1.27,-1.27; 20 1.27,1.27; 21 3.81,-1.27; 22 3.81,1.27; 23 6.35,-1.27; 24 6.35,1.27; 25 8.89,-1.27; 26 8.89,1.27; 27 11.43,-1.27; 28 11.43,1.27; 29 13.97,-1.27; 30 13.97,1.27; 31 16.51,-1.27; 32 16.51,1.27; 33 19.05,-1.27; 34 19.05,1.27; 35 21.59,-1.27; 36 21.59,1.27
DFN200X300X60-7N = smd 0.5 x 0.75: 1 -1.35,0.6; 6 1.35,0.6 | smd 0.5 x 0.4: 2 -1.35,-0.175; 3 -1.35,-0.775; 4 1.35,-0.775; 5 1.35,-0.175 | smd 1.8 x 1.8: 7 0,0
BGA12C40P4X3_137X201X65 = smd 0.2 x 0.2: A1 0.4,0.6; A3 -0.4,0.6; B1 0.4,0.2; B2 0,0.2; B3 -0.4,0.2; C1 0.4,-0.2; C3 -0.4,-0.2; D1 0.4,-0.6; D2 0,-0.6; D3 -0.4,-0.6
BGA8C40P2X4_99X159X42 = smd 0.242 x 0.242: A1 -0.2,0.6; A2 0.2,0.6; B1 -0.2,0.2; B2 0.2,0.2; C1 -0.2,-0.2; C2 0.2,-0.2; D1 -0.2,-0.6; D2 0.2,-0.6
SOT95P280X110-6 = smd 1.259 x 0.609: 1 -1.228,0.95; 2 -1.228,0; 3 -1.228,-0.95; 4 1.228,-0.95; 5 1.228,0; 6 1.228,0.95

### Placement (x,y rotation side)
C1  40.4,8.4 270 top
C2  51.8,22.6 0 top
C3  40.6,31.4 90 top
C4  45.8,31.4 90 top
C5  31.2,31.4 90 top
C6  36.6,31.4 90 top
C7  42,8.4 270 top
C8  43.8,8.4 270 top
C9  51.8,13.4 0 top
C10  51.8,16 0 top
C11  51.8,19.2 0 top
C12  51.8,21.2 0 top
C13  51.8,26.8 0 top
C14  25.1,31.5 0 top
C15  25.6,29.5 0 top
C16  13.1,30 0 top
C17  38,31.4 90 top
C18  28.4,21.8 180 top
C19  28.6,14.6 180 top
C20  51.8,24 0 top
C21  51.8,25.4 0 top
C22  49.4,31.4 90 top
C23  48.2,31.4 90 top
C25  39.4,31.4 90 top
C26  51.8,30.6 180 top
C27  51.8,29.2 0 top
C41  3.5,23.15 180 top
C42  3.5,22 180 top
CON1  15,13 270 top
CON2  1.6,30.2 270 top
IC1  40,20 0 top
LED1  1,23 270 top
Q1  43.2,31.4 180 top
Q2  33.8,31.4 180 top
R1  51.8,31.8 0 top
R2  51.8,28 180 top
R3  47,31.4 270 top
R4  21.6,29 180 top
R5  24.6,27.5 0 top
R6  16.1,29 180 top
R7  13.1,31.5 0 top
R8  18.6,29.5 270 top
S1  63.8,4.3 0 top
SV1  30,37 0 top
U1  16.1,31.5 0 top
U2  21.6,31.5 0 top
U40  3.5,24.5 270 top
U$1  9,29.5 0 top

### Tracks (layer width: path | path; a pad name or v marks a point on that pad's centre or on a via)
BAT_M  (3 unrouted)
BAT_MINUS  (4 unrouted)
BAT_PLUS  (3 unrouted)
GND  (42 unrouted)
  pour Bottom (isolate 0.3, rank 6, no thermals): -1,41 -1,-1 81,-1 81,41
LED_BLUE  (1 unrouted)
LED_GREEN  (1 unrouted)
LED_RED  (1 unrouted)
N$13  (2 unrouted)
N$15  (2 unrouted)
N$18  (1 unrouted)
RCC_HSE_IN  (2 unrouted)
  Top 0.2: 42.5,30.5 Q1.3
RCC_HSE_OUT  (1 unrouted)
  Top 0.2: C4.1 44.35,32.2 Q1.1
RCC_LSE_IN  (2 unrouted)
RCC_LSE_OUT  (2 unrouted)
SVREF  (5 unrouted)
SZQ  (1 unrouted)
  Top 0.2: R3.2 47,30.7
VDD_3V3  (3 unrouted)
VDD_CPU  (13 unrouted)
VDD_RAM  (18 unrouted)
  Top 0.2: 44.2,26.78 IC1.70 | IC1.72 43.4,26.78
VDD_SYS  (11 unrouted)